# EAGLE design dcf77_26v0v0 (EAGLE 6.6.0)
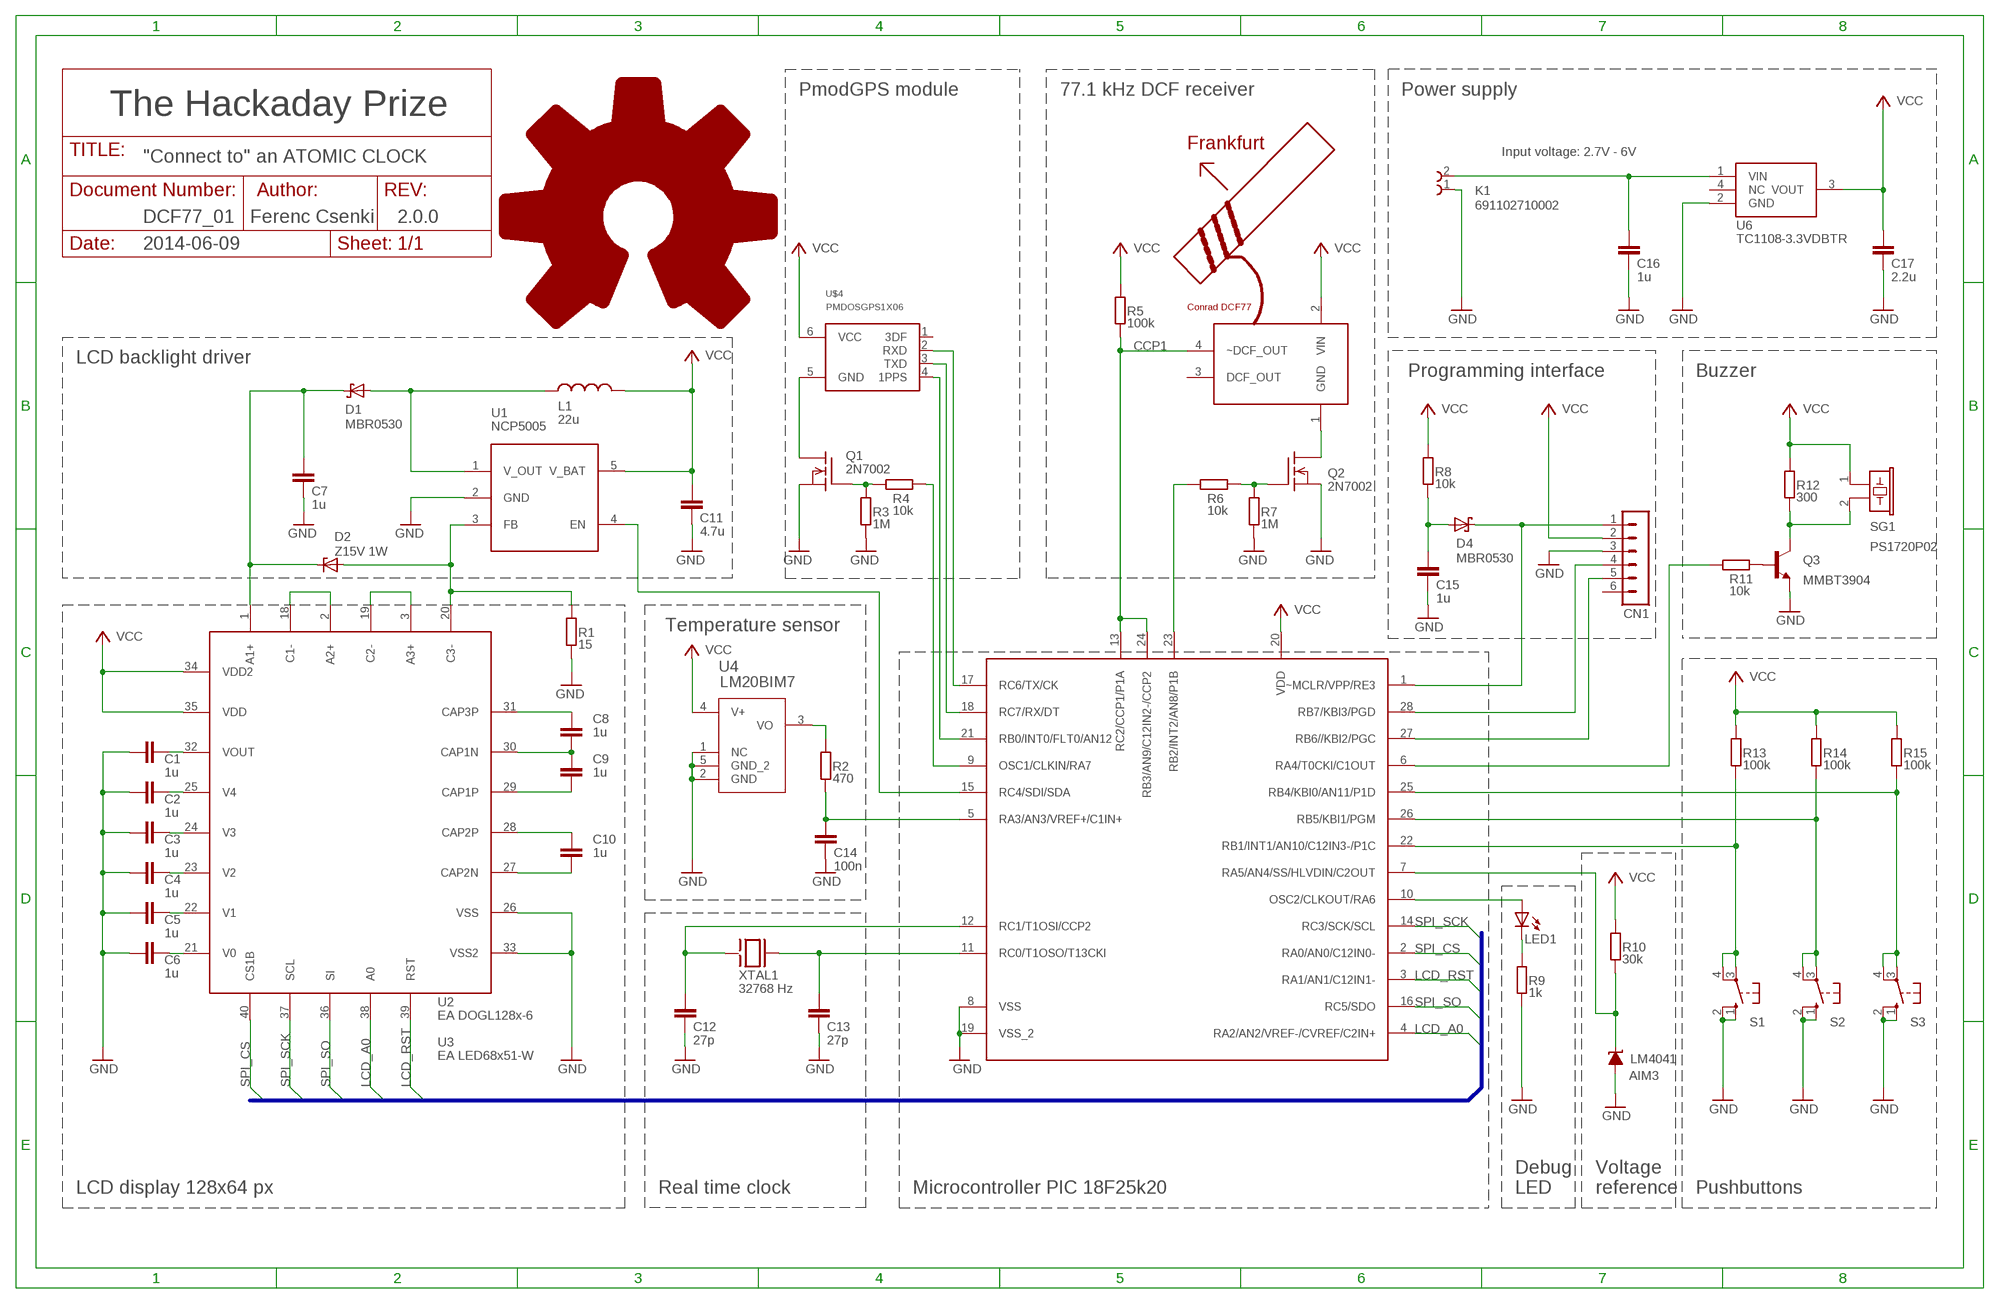
[diagram p0: schematic, sheet 1]

## Parts
C1  1u  C-EUC1206K  [C1206K]
C2  1u  C-EUC1206K  [C1206K]
C3  1u  C-EUC1206K  [C1206K]
C4  1u  C-EUC1206K  [C1206K]
C5  1u  C-EUC1206K  [C1206K]
C6  1u  C-EUC1206K  [C1206K]
C7  1u  C-EUC1206K  [C1206K]
C8  1u  C-EUC1206K  [C1206K]
C9  1u  C-EUC1206K  [C1206K]
C10  1u  C-EUC1206K  [C1206K]
C11  4.7u  C-EUC1206K  [C1206K]
C12  27p  C-EUC1206K  [C1206K]
C13  27p  C-EUC1206K  [C1206K]
C14  100n  C-EUC1206K  [C1206K]
C15  1u  C-EUC1206K  [C1206K]
C16  1u  C-EUC1206K  [C1206K]
C17  2.2u  C-EUC1206K  [C1206K]
CN1  MA06-1  [MA06-1]
D1  MBR0530  SCHOTTKY-DIODE  [SOD123]
D2  Z15V 1W  ZENER-DIODESMB  [SMB]
D4  MBR0530  SCHOTTKY-DIODE  [SOD123]
K1  691102710002  [691102710002]
K2  691121710004DCF77_PINHEADER  [1X06]
L1  22u  L-USL1812  [L1812]
LED1  LEDCHIPLED_1206  [CHIPLED_1206]
LM4041  LM4041A12DBZ  [DBZ_R-PDSO-G3]
MMBT3904  T1  BC849SMD  [SOT23-BEC]
Q1  2N7002  [SOT23]
Q2  2N7002  [SOT23]
R1  15  R-EU_R1206  [R1206]
R2  470  R-EU_R1206  [R1206]
R3  1M  R-EU_R1206  [R1206]
R4  10k  R-EU_R1206  [R1206]
R5  100k  R-EU_R1206  [R1206]
R6  10k  R-EU_R1206  [R1206]
R7  1M  R-EU_R1206  [R1206]
R8  10k  R-EU_R1206  [R1206]
R9  1k  R-EU_R1206  [R1206]
R10  30k  R-EU_R1206  [R1206]
R11  10k  R-EU_R1206  [R1206]
R12  300  R-EU_R1206  [R1206]
R13  100k  R-EU_R1206  [R1206]
R14  100k  R-EU_R1206  [R1206]
R15  100k  R-EU_R1206  [R1206]
S1  40-XX  [B3F-40XX]
S2  40-XX  [B3F-40XX]
S3  40-XX  [B3F-40XX]
SG1  F/EE17P  [F/EE17P]
U1  NCP5005  [LTC6900]
U4  LM20BIM7  [SOT65P240X110-5N]
U6  TC1108-3.3VDBTR  3V3REGSOT223  [SOT223]
U$2  DOGL128_DEV  [EA_DOGL128-6]
U$4  PMDOSGPS1X06  [1X06]
U$113  PICDIL28VARIANT  [DIL28]
XTAL1  32768 Hz  38KHZ  [38KHZ]

## Nets
B1: MMBT3904.C R12.2 SG1.2
CCP1: K2.4(~DCF_OUT) R5.1 U$113.13(RC2/CCP1/P1A) U$113.24(RB3/AN9/C12IN2-/CCP2)
GND: C1.1 C2.1 C3.1 C4.1 C5.1 C6.1 C7.1 C11.1 C12.1 C13.1 C14.2 C15.1 C16.1 C17.1 CN1.3 K1.1 LM4041.2(A) MMBT3904.E Q1.2(S) Q2.2(S) R1.1 R3.2 R7.2 R9.1 S1.1(S) S1.2(S1) S2.1(S) S2.2(S1) S3.1(S) S3.2(S1) U1.2(GND) U4.1(NC) U4.2(GND) U4.5(GND_2) U6.2(GND) U$2.26(VSS) U$2.33(VSS2) U$113.8(VSS) U$113.19(VSS_2)
LCD_A0: U$2.38(A0) U$113.4(RA2/AN2/VREF-/CVREF/C2IN+)
LCD_RST: U$2.39(RST) U$113.3(RA1/AN1/C12IN1-)
N$1: C10.2 U$2.27(CAP2N)
N$2: C10.1 U$2.28(CAP2P)
N$3: C9.1 U$2.29(CAP1P)
N$4: C8.2 U$2.31(CAP3P)
N$5: C3.2 U$2.24(V3)
N$6: C8.1 C9.2 U$2.30(CAP1N)
N$7: C4.2 U$2.23(V2)
N$8: C5.2 U$2.22(V1)
N$9: C6.2 U$2.21(V0)
N$10: C12.2 U$113.12(RC1/T1OSI/CCP2) XTAL1.P$1
N$11: C13.2 U$113.11(RC0/T1OSO/T13CKI) XTAL1.P$2
N$12: C2.2 U$2.25(V4)
N$13: C1.2 U$2.32(VOUT)
N$14: K2.1(GND) Q2.3(D)
N$15: CN1.1 D4.C U$113.1(~MCLR/VPP/RE3)
N$16: LED1.A U$113.10(OSC2/CLKOUT/RA6)
N$17: CN1.4 U$113.28(RB7/KBI3/PGD)
N$18: CN1.5 U$113.27(RB6//KBI2/PGC)
N$19: R13.1 S1.3(P) S1.4(P1) U$113.22(RB1/INT1/AN10/C12IN3-/P1C)
N$20: R14.1 S2.3(P) S2.4(P1) U$113.26(RB5/KBI1/PGM)
N$21: R15.1 S3.3(P) S3.4(P1) U$113.25(RB4/KBI0/AN11/P1D)
N$22: D1.A L1.1 U1.1(V_OUT)
N$23: R4.2 U$113.9(OSC1/CLKIN/RA7)
N$24: C7.2 D1.C D2.C U$2.1(A1+)
N$25: U$2.2(A2+) U$2.18(C1-)
N$26: U$2.3(A3+) U$2.19(C2-)
N$27: LED1.C R9.2
N$28: U$4.2(RXD) U$113.17(RC6/TX/CK)
N$29: U1.4(EN) U$113.15(RC4/SDI/SDA)
N$30: D2.A R1.2 U1.3(FB) U$2.20(C3-)
N$31: R11.2 U$113.6(RA4/T0CKI/C1OUT)
N$33: R6.2 U$113.23(RB2/INT2/AN8/P1B)
N$34: C16.2 K1.2 U6.1(VIN)
N$35: LM4041.1(C) R10.2 U$113.7(RA5/AN4/SS/HLVDIN/C2OUT)
N$36: Q1.3(D) U$4.5(GND)
N$37: Q2.1(G) R6.1 R7.1
N$38: C15.2 D4.A R8.1
N$39: Q1.1(G) R3.1 R4.1
N$40: R2.2 U4.3(VO)
N$41: U$4.3(TXD) U$113.18(RC7/RX/DT)
N$42: C14.1 R2.1 U$113.5(RA3/AN3/VREF+/C1IN+)
N$43: MMBT3904.B R11.1
N$44: U$4.4(1PPS) U$113.21(RB0/INT0/FLT0/AN12)
SPI_CS: U$2.40(CS1B) U$113.2(RA0/AN0/C12IN0-)
SPI_SCK: U$2.37(SCL) U$113.14(RC3/SCK/SCL)
SPI_SO: U$2.36(SI) U$113.16(RC5/SDO)
VCC: C11.2 C17.2 CN1.2 K2.2(VIN) L1.2 R5.2 R8.2 R10.1 R12.1 R13.2 R14.2 R15.2 SG1.1 U1.5(V_BAT) U4.4(V+) U6.3(VOUT) U$2.34(VDD2) U$2.35(VDD) U$4.6(VCC) U$113.20(VDD)
Unconnected: CN1.6 K2.3(DCF_OUT) U6.4(NC) U$4.1(3DF)

## Buses
SPI_CS,LCD_RST,LCD_A0,SPI_SCK,SPI_SO

## Notes on the sheet
- PmodGPS module | 77.1 kHz DCF receiver | Power supply
- The Hackaday Prize
- Input voltage: 2.7V - 6V
- "Connect to" an ATOMIC CLOCK
- DCF77_01 | Ferenc Csenki | 2.0.0
- 2014-06-09
- LCD backlight driver
- Programming interface | Buzzer
- PS1720P02
- Q3
- Temperature sensor
- U2
- EA DOGL128x-6
- U3
- EA LED68x51-W
- AIM3
- Debug | Voltage
- LCD display 128x64 px | Real time clock | Microcontroller PIC 18F25k20 | LED | reference | Pushbuttons

## Library data of the parts
C1-C17 = resistor:C-EU: CAPACITOR, European symbol
CN1 = con-lstb:MA06-1: PIN HEADER; OC_FARNELL: unknown; OC_NEWARK: unknown
D1 D4 = diode:SCHOTTKY-DIODE: Schottky Diode
D2 = diode:ZENER-DIODE: Z-Diode
K1 = Wuerth_Elektronik_eiCan_Terminal_Blocks_Connectors:691102710002: WR-TBL Serie 102 - 5.0mm Horizontal Entry Modular with Pressure Clamp - 1.5mm2 Wires, 2 Pins
K2 = conrad_dcf77:691121710004: WR-TBL Serie 121 - 5.0mm Horizontal Entry Modular With Pressure Clamp - 3.3mm2 Wires, 4 Pins
L1 = rcl:L-US: INDUCTOR, American symbol
LED1 = led:LED: LED OSRAM: - CHIPLED LG R971, LG N971, LY N971, LG Q971, LY Q971, LO R971, LY R971 LH N974, LH R974 LS Q976, LO Q976, LY Q976 LO Q996 - Hyper CHIPLED LW Q18S LB Q993, LB Q99A, LB R99A - SideLED LS A670, LO A670, LY A670, LG A670, LP A670 LB A673, LV A673, LT A673, LW A673 LH A674 LY A675 LS A676, LA A676, LO A676, LY A676, LW A676 LS A679, LY A679, LG A679 - Hyper Micro SIDELED® LS Y876, LA Y876, LO Y876, LY Y876 LT Y87S - SmartLED LW L88C, LW L88S LB L89C, LB L89S, LG L890 LS L89K, LO L89K, LY L89K LS L896, LA L896, LO L896, LY L896 - TOPLED LS T670, LO T670, LY T670, LG T670, LP T670 LSG T670, LSP T670, LSY T670, LOP T670, LYG T670 LG T671, LOG T671, LSG T671 LB T673, LV T673, LT T673, LW T673 LH T674 LS T676, LA T676, LO T676, LY T676, LB T676, LH T676, LSB T676, LW T676 LB T67C, LV T67C, LT T67C, LS T67K, LO T67K, LY T67K, LW E67C LS E67B, LA E67B, LO E67B, LY E67B, LB E67C, LV E67C, LT E67C LW T67C LS T679, LY T679, LG T679 LS T770, LO T770, LY T770, LG T770, LP T770 LB T773, LV T773, LT T773, LW T773 LH T774 LS E675, LA E675, LY E675, LS T675 LS T776, LA T776, LO T776, LY T776, LB T776 LHGB T686 LT T68C, LB T68C - Hyper Mini TOPLED® LB M676 - Mini TOPLED Santana® LG M470 LS M47K, LO M47K, LY M47K Source: http://www.osram.convergy.de LUXEON: - LUMILED® LXK2-PW12-R00, LXK2-PW12-S00, LXK2-PW14-U00, LXK2-PW14-V00 LXK2-PM12-R00, LXK2-PM12-S00, LXK2-PM14-U00 LXK2-PE12-Q00, LXK2-PE12-R00, LXK2-PE12-S00, LXK2-PE14-T00, LXK2-PE14-U00 LXK2-PB12-K00, LXK2-PB12-L00, LXK2-PB12-M00, LXK2-PB14-N00, LXK2-PB14-P00, LXK2-PB14-Q00 LXK2-PR12-L00, LXK2-PR12-M00, LXK2-PR14-Q00, LXK2-PR14-R00 LXK2-PD12-Q00, LXK2-PD12-R00, LXK2-PD12-S00 LXK2-PH12-R00, LXK2-PH12-S00 LXK2-PL12-P00, LXK2-PL12-Q00, LXK2-PL12-R00 Source: www.luxeon.com KINGBRIGHT: KA-3528ASYC Source: www.kingbright.com
LM4041 = texas:LM4041: PRECISION MICROPOWER SHUNT VOLTAGE REFERENCE Source: http://focus.ti.com/lit/ds/slcs146e/slcs146e.pdf; MPN: LM4041A12IDBZR; OC_FARNELL: 1407949; OC_NEWARK: 58K5875
MMBT3904 = transistor-npn:BC849*: NPN Transistor
Q1 Q2 = transistors_gaui:2N7002
R1-R15 = rcl:R-EU_: RESISTOR, European symbol
S1-S3 = switch-omron:40-XX: OMRON SWITCH; MF: OMRON COMPONENTS USA; MPN: B3F-4000; OC_FARNELL: 176434; OC_NEWARK: 36K3105
SG1 = buzzer:F/EE17P: BUZZER Source: Buerklin; OC_FARNELL: unknown; OC_NEWARK: unknown
U1 = NCP5005:NCP5005
U4 = lm20:LM20BIM7: micro SMD Temperature Sensor; MPN: LM20BIM7; OC_FARNELL: 9779264; OC_NEWARK: 25C3870; PACKAGE: SC-70-5; SUPPLIER: National Semiconductors
U6 = 3v3reg:3V3REG
U$2 = ea:DOGL128_DEV
U$4 = PmodGPS:PMDOSGPS
U$113 = pic:PIC
XTAL1 = xtal:38KHZ

## Board
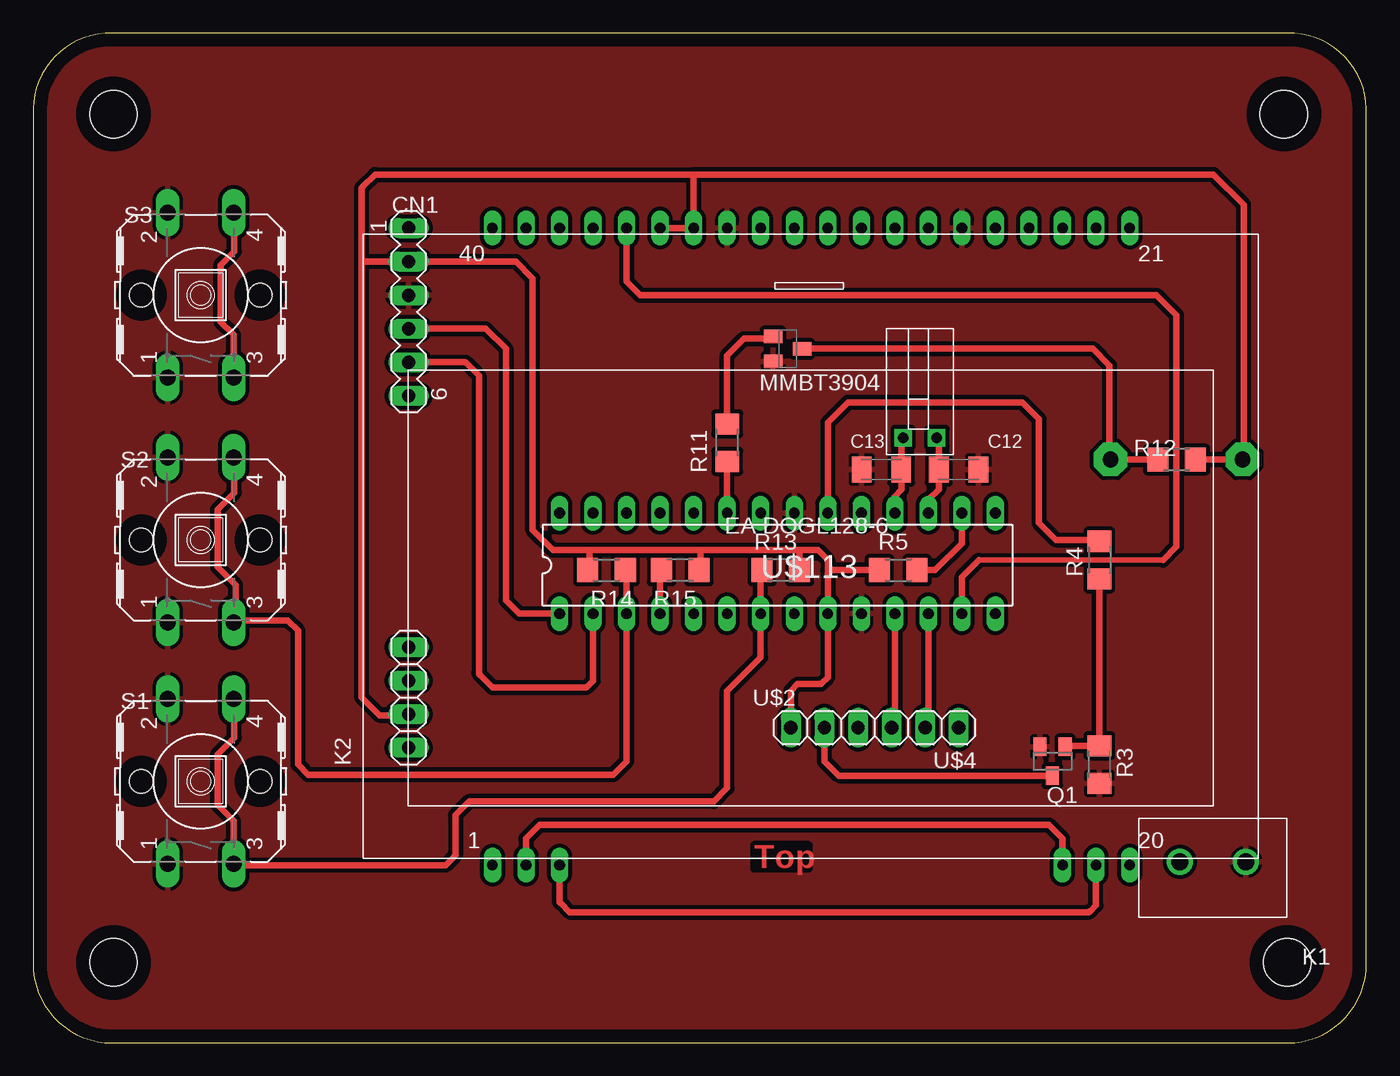
[diagram p1: board, top side]
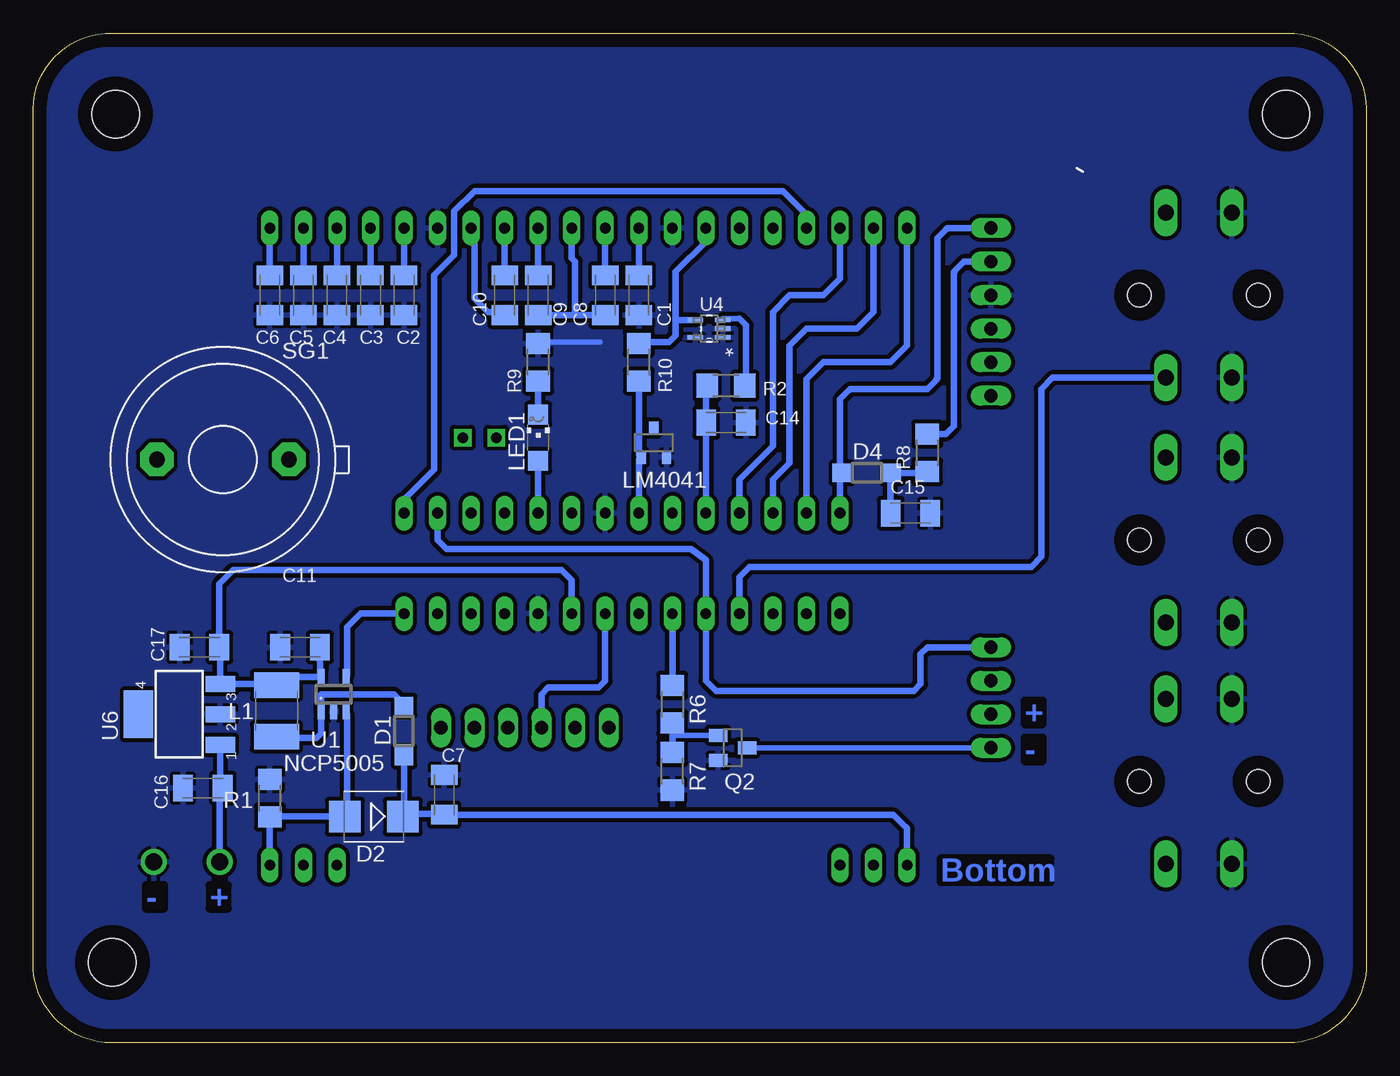
[diagram p2: board, bottom side, seen from below]

Size 101 x 76.5 mm. Coordinates in mm from the lower left corner, seen from the top.
Outline: 101,6 101,70.75 arc90 95,76.5 6,76.5 arc90 0,70.75 0,6 arc90 6,0 95,0 arc90 101,6
Copper layers (1*16): Top 0.035mm / dielectric 1.5mm / Bottom 0.035mm
Design rules "default *": minimum track width 20mil, minimum drill 24mil, track to track 12mil, track to pad 12mil, pad to pad 12mil, via to via 12mil, smd to smd 12mil, copper to edge 40mil, drill to drill 8mil, minimum pad ring 10mil, minimum via ring 8mil, stop-mask expansion 4mil, vias tented up to drill 0mil, thermal gap 10mil
Holes 3.6 mm at 6.1,70.36 95,6.1 94.74,70.36 6.1,6.1

### Footprints (pad centres in the part's own frame; a part is rotated, then mirrored left to right if it is on the bottom)
C1206K = smd 1.5 x 2: 1 -1.5,0; 2 1.5,0
MA06-1 = drill 1.016 long: 1 -6.35,0; 2 -3.81,0; 3 -1.27,0; 4 1.27,0; 5 3.81,0; 6 6.35,0
SOD123 = smd 1.4 x 1.4: A 1.9,0; C -1.9,0
SMB = smd 2.4 x 2.4: A 2.2,0; C -2.2,0
691102710002 = drill 1.3: 1 -5,0; 2 0,0
1X06 = drill 1.016 long: 1 -1.27,0; 2 1.27,0; 3 3.81,0; 4 6.35,0
L1812 = smd 1.9 x 3.4: 1 -1.95,0; 2 1.95,0
CHIPLED_1206 = smd 1.5 x 1.5: A 0,-1.75; C 0,1.75
DBZ_R-PDSO-G3 = smd 0.7 x 1: 1 -0.95,-1.1; 2 0.95,-1.1; 3 0,1.1
SOT23-BEC = smd 1 x 1.4: B -0.95,-1.1; C 0,1.1; E 0.95,-1.1
SOT23 = smd 1 x 1.4: 1 -0.95,-1.1; 2 0.95,-1.1; 3 0,1.1
R1206 = smd 1.6 x 1.803: 1 -1.422,0; 2 1.422,0
B3F-40XX = drill 1.194 long: 1 -6.248,2.489; 2 6.248,2.489; 3 -6.248,-2.489; 4 6.248,-2.489 | hole 1.803: 0,-4.496; 0,4.496
F/EE17P = drill 1.194 pad 2.54 octagon: 1 -5.004,0; 2 5.004,0
LTC6900 = smd 0.55 x 1.2: 1 -0.95,-1.3; 2 0,-1.3; 3 0.95,-1.3; 4 0.95,1.3; 5 -0.95,1.3
SOT65P240X110-5N = smd 1.168 x 0.356: 1 -1.041,0.66; 2 -1.041,0; 3 -1.041,-0.66; 4 1.041,-0.66; 5 1.041,0.66
SOT223 = smd 1.219 x 2.235: 1 -2.311,-3.099; 2 0,-3.099; 3 2.311,-3.099 | smd 3.6 x 2.2: 4 0,3.099
EA_DOGL128-6 = drill 0.813 long: 1 0,0; 2 2.54,0; 3 5.08,0; 18 43.18,0; 19 45.72,0; 20 48.26,0; 21 48.26,48.26; 22 45.72,48.26; 23 43.18,48.26; 24 40.64,48.26; 25 38.1,48.26; 26 35.56,48.26; 27 33.02,48.26; 28 30.48,48.26; 29 27.94,48.26; 30 25.4,48.26; 31 22.86,48.26; 32 20.32,48.26; 33 17.78,48.26; 34 15.24,48.26; 35 12.7,48.26; 36 10.16,48.26; 37 7.62,48.26; 38 5.08,48.26; 39 2.54,48.26; 40 0,48.26
1X06' = drill 1.016 long: 1 -6.35,0; 2 -3.81,0; 3 -1.27,0; 4 1.27,0; 5 3.81,0; 6 6.35,0
DIL28 = drill 0.813 long: 1 -15.24,7.62; 2 -12.7,7.62; 3 -10.16,7.62; 4 -7.62,7.62; 5 -5.08,7.62; 6 -2.54,7.62; 7 0,7.62; 8 2.54,7.62; 9 5.08,7.62; 10 7.62,7.62; 11 10.16,7.62; 12 12.7,7.62; 13 15.24,7.62; 14 17.78,7.62; 15 17.78,0; 16 15.24,0; 17 12.7,0; 18 10.16,0; 19 7.62,0; 20 5.08,0; 21 2.54,0; 22 0,0; 23 -2.54,0; 24 -5.08,0; 25 -7.62,0; 26 -10.16,0; 27 -12.7,0; 28 -15.24,0
38KHZ = drill 0.8 square: P$1 8.255,0.635; P$2 8.255,-1.905

### Placement (x,y rotation side)
C1  55.12,56.64 90 bottom
C2  72.9,56.64 90 bottom
C3  75.44,56.64 90 bottom
C4  77.98,56.64 90 bottom
C5  80.52,56.64 90 bottom
C6  83.06,56.64 90 bottom
C7  69.85,18.8 270 bottom
C8  57.66,56.64 90 bottom
C9  62.74,56.64 270 bottom
C10  65.28,56.64 270 bottom
C11  80.77,29.97 0 bottom
C12  70.1,43.43 180 top
C13  64.26,43.43 0 top
C14  48.51,46.99 0 bottom
C15  34.54,40.13 180 bottom
C16  88.14,19.3 0 bottom
C17  88.39,29.97 0 bottom
CN1  28.45,55.37 270 top
D1  72.9,23.62 90 bottom
D2  75.18,17.14 180 bottom
D4  37.85,43.18 0 bottom
K1  86.87,13.72 180 top
K2  28.45,23.62 90 top
L1  82.55,25.15 90 bottom
LED1  62.74,45.85 0 bottom
LM4041  53.98,45.47 0 bottom
MMBT3904  57.15,52.58 270 top
Q1  77.22,21.34 180 top
Q2  48.01,22.35 270 bottom
R1  83.06,18.54 270 bottom
R2  48.51,49.78 0 bottom
R3  80.77,21.08 270 top
R4  80.77,36.58 90 top
R5  65.53,35.81 180 top
R6  52.58,25.65 90 bottom
R7  52.58,20.57 270 bottom
R8  33.27,44.7 90 bottom
R9  62.74,51.56 270 bottom
R10  55.12,51.56 270 bottom
R11  52.58,45.47 270 top
R12  86.61,44.2 180 top
R13  56.64,35.81 0 top
R14  43.43,35.81 180 top
R15  49.02,35.81 0 top
S1  12.7,19.81 90 top
S2  12.7,38.1 90 top
S3  12.7,56.64 90 top
SG1  86.61,44.2 0 bottom
U1  78.23,26.42 0 bottom
U4  49.78,54.1 180 bottom
U6  89.92,24.89 90 bottom
U$2  34.8,13.46 0 top
U$3  [OSHW_8X350_NOTEXT]  24.89,65.53 0 bottom
U$4  PMDOSGPS1X06  [1X06']  63.75,23.88 180 top
U$113  55.12,32.51 0 top
XTAL1  67.82,54.1 270 top

### Tracks (layer width: path | path; a pad name or v marks a point on that pad's centre or on a via)
B1
  Top 0.508: R12.2 SG1.2 81.53,44.27 81.53,51.31 80.26,52.58 MMBT3904.C
CCP1
  Top 0.508: U$113.13 70.36,37.85 68.33,35.81 R5.1
  Bottom 0.508: U$113.13 70.36,38.1 69.69,37.43 51.15,37.43 50.04,36.58 U$113.24 50.04,27.43 49.28,26.67 34.29,26.67 33.78,27.18 33.78,29.46 33.27,29.97 K2.4
GND
  Bottom 0.406: 58.04,53.09 62.74,53.09
  Bottom 0.508: 62.74,53.09 R9.1
  pour Bottom: 100.6,6.46 100.82,69.96 arc90 94.85,75.98 6.5,76.42 arc90 0.47,70.46 0.04,6.07 arc91 6.07,0.03 94.63,0.48 arc90
  pour Top: 0.47,70.48 0.55,6.07 arc91 6.58,0.03 94.61,0.48 arc90 100.58,6.48 100.58,70.22 arc90 94.6,76.22 6.48,76.44 arc90
LCD_A0
  Bottom 0.508: U$2.38 39.88,57.91 41.15,56.64 43.69,56.64 44.96,55.37 44.96,45.21 47.5,42.67 U$113.4
LCD_RST
  Bottom 0.508: U$2.39 37.34,55.37 38.61,54.1 42.42,54.1 43.69,52.83 43.69,43.94 44.96,42.67 U$113.3
N$1
  Bottom 0.508: U$2.27 67.82,60.71 67.56,60.45 67.56,56.39 66.55,55.37 65.28,55.37 C10.2
N$2
  Bottom 0.508: C10.1 U$2.28
N$3
  Bottom 0.508: C9.1 U$2.29
N$4
  Bottom 0.508: C8.2 U$2.31
N$5
  Bottom 0.508: C3.2 U$2.24
N$6
  Bottom 0.508: 59.94,55.12 62.74,55.12 C9.2 | 59.94,55.12 57.66,55.12 C8.1 | U$2.30 60.2,59.44 59.94,59.18 59.94,55.12
N$7
  Bottom 0.508: C4.2 U$2.23
N$8
  Bottom 0.508: C5.2 U$2.22
N$9
  Bottom 0.508: U$2.21 C6.2
N$10
  Top 0.508: U$113.12 67.82,41.15 68.6,41.93 C12.2 68.6,45.7 XTAL1.P$1
N$11
  Top 0.406: C13.2 65.79,43.43
  Top 0.508: 65.79,43.43 65.79,41.91 65.28,41.4 U$113.11 | C13.2 65.76,43.66 65.79,43.69 65.79,45.72 XTAL1.P$2
N$12
  Bottom 0.508: C2.2 U$2.25
N$13
  Bottom 0.508: C1.2 U$2.32
N$14
  Bottom 0.406: K2.1 Q2.3
N$15
  Bottom 0.508: CN1.1 31.64,61.72 arc-45 31.82,61.65 32.51,60.96 32.51,50.4 arc45 32.59,50.22 33.27,49.53 39.01,49.53 arc-45 39.19,49.46 39.88,48.77 39.88,43.42 arc-45 39.8,43.24 D4.C 39.8,43.12 arc-45 39.88,42.94 U$113.1
N$16
  Bottom 0.508: U$113.10 LED1.A
N$17
  Top 0.508: CN1.4 34.29,54.1 35.81,52.58 35.81,33.53 36.83,32.51 U$113.28
N$18
  Top 0.508: U$113.27 42.42,27.43 41.98,27 arc-45 41.8,26.92 34.8,26.92 33.86,27.87 arc-45 33.78,28.05 33.78,50.55 32.84,51.49 arc45 32.66,51.56 CN1.5
N$19
  Top 0.508: S1.4 15.24,26.01 15.24,23.11 13.97,21.84 13.97,18.03 15.19,16.82 S1.3 15.29,13.46 31.24,13.46 31.93,14.15 arc45 32,14.33 32,17.27 32.95,18.21 arc-45 33.12,18.29 51.56,18.29 52.58,19.3 52.58,26.67 55.12,29.21 U$113.22 55.12,36.47 R13.1
N$20
  Top 0.508: 15.34,32 19.3,32 20.07,31.24 20.07,21.08 20.83,20.32 43.94,20.32 44.96,21.34 U$113.26 44.96,35.71 R14.1 | 15.34,32 S2.3 | 15.34,32 15.34,34.7 13.97,36.07 13.97,40.39 15.24,41.66 15.24,44.3 S2.4
N$21
  Top 0.508: S3.3 15.19,53.64 14.22,54.61 14.22,58.93 15.24,59.94 15.24,62.84 S3.4 | U$113.25 47.5,35.71 R15.1
  Bottom 0.508: S3.3 23.77,50.39 24.64,49.53 24.64,36.83 25.4,36.07 46.74,36.07 47.5,35.31 U$113.25
N$22
  Bottom 0.406: 82.47,23.11 L1.1 | D1.A 72.9,25.55 arc-45 72.97,25.73 | 79.25,25.53 arc-45 U1.1
  Bottom 0.508: 82.47,23.11 79.5,23.11 79.18,23.43 U1.1 79.18,26.42 78.49,26.42 73.66,26.42 72.97,25.73
N$23
  Top 0.508: U$113.9 60.2,46.99 61.72,48.51 74.93,48.51 76.2,47.24 76.2,39.37 77.47,38.1 80.67,38.1 R4.2
N$24
  Bottom 0.406: 72.9,17.14 D2.C 72.97,17.16 arc-45 72.9,17.34
  Bottom 0.508: D1.C 72.9,17.34 70.25,17.34 arc45 70.07,17.26 C7.2 arc-45 69.79,17.27 35.81,17.27 34.87,16.33 arc45 34.8,16.15 U$2.1
N$25
  Top 0.508: U$2.18 77.98,15.49 76.96,16.51 38.35,16.51 37.34,15.49 U$2.2
N$26
  Top 0.508: 39.88,11.18 U$2.3 39.88,10.77 arc45 39.95,10.59 40.64,9.91 79.91,9.91 arc45 80.08,9.98 80.52,10.41 U$2.19
N$27
  Bottom 0.508: LED1.C R9.2
N$28
  Top 0.508: U$113.17 67.82,24.13 U$4.2
N$29
  Bottom 0.508: U$113.15 76.2,32.51 77.22,31.5 77.22,27.78 U1.4
N$30
  Bottom 0.406: 83.06,17.14 R1.2 | 77.22,17.02 77.47,17.02 77.38,17.1 | 77.31,25.15 U1.3 77.28,24.96 77.22,24.89
  Bottom 0.508: 82.8,17.27 83.06,17.27 R1.2 | 82.8,17.27 82.3,17.27 | R1.2 82.8,17.27 | U$2.20 R1.2 | 83.06,17.14 D2.A 77.38,17.1 | 77.22,24.89 77.22,17.02
N$31
  Top 0.508: U$113.6 R11.2
N$33
  Bottom 0.508: R6.2 U$113.23
N$34
  Bottom 0.508: U6.1 86.82,19.3 C16.2 86.87,19.3 K1.2
N$35
  Bottom 0.508: R10.2 55.12,44.56 LM4041.1 55.12,44.17 U$113.7
N$36
  Top 0.508: U$4.5 59.94,21.34 61.04,20.24 Q1.3
N$37
  Bottom 0.406: 52.43,24.38 R6.1 | Q2.1 52.51,23.3 52.58,23.37
  Bottom 0.508: R7.1 52.58,23.37 R6.1
N$38
  Bottom 0.508: C15.2 36.04,42.98 arc45 35.97,43.16 D4.A 33.48,43.18 arc-45 33.3,43.25 R8.1
N$39
  Top 0.508: Q1.1 78.23,22.5 R3.1 R4.1
N$40
  Bottom 0.406: 47.5,54.86 48.74,54.86 U4.3
  Bottom 0.508: R2.2 46.99,49.78 46.99,54.36 47.5,54.86
N$41
  Top 0.508: U$113.18 65.28,24.13 U$4.3
N$42
  Bottom 0.406: C14.1 50.04,46.99
  Bottom 0.508: 50.04,46.99 50.04,49.78 R2.1 | C14.1 50.01,40.16 U$113.5
N$43
  Top 0.508: R11.1 52.58,52.07 53.85,53.34 55.86,53.34 MMBT3904.B
N$44
  Bottom 0.508: U$4.4 62.48,26.42 61.98,26.92 58.17,26.92 57.66,27.43 U$113.21
SPI_CS
  Bottom 0.508: U$2.40 34.8,52.83 36.07,51.56 41.15,51.56 42.42,50.29 U$113.2
SPI_SCK
  Bottom 0.508: U$113.14 72.9,41.15 70.61,43.43 70.61,58.17 69.09,59.69 69.09,62.99 67.56,64.52 44.2,64.52 42.42,62.74 U$2.37
SPI_SO
  Top 0.406: 85.6,36.58 71.63,36.58
  Top 0.508: U$2.36 44.96,57.76 arc45 45.03,57.58 45.97,56.64 85.09,56.64 86.61,55.12 86.61,37.59 85.6,36.58 | 70.36,32.26 U$113.16 70.36,35.31 71.63,36.58
VCC
  Top 0.508: SG1.1 R12.1 91.69,44.2 91.69,63.5 89.41,65.79 50.04,65.79 | U$2.35 U$2.34 50.04,65.79 | 24.89,59.18 24.89,64.67 arc-45 24.97,64.84 25.91,65.79 50.04,65.79 | 24.89,59.18 24.89,26.16 26.24,24.81 28.45,24.81 K2.2 | 24.89,59.18 CN1.2 36.58,59.18 37.85,57.91 37.85,38.86 39.37,37.34 42.16,37.34 | U$4.6 57.4,26.67 57.91,27.18 59.69,27.18 60.2,27.69 U$113.20 60.2,35.81 | 60.2,35.81 60.2,36.58 59.44,37.34 57.91,37.34 | 42.16,37.34 50.55,37.34 | 50.55,37.34 57.91,37.34 | R14.2 42.16,35.81 42.16,37.34 | R15.2 50.55,35.81 50.55,37.34 | R5.2 60.2,35.81 | R13.2 58.06,37.19 57.91,37.34
  Bottom 0.508: 55.12,53.09 R10.1 55.02,53.09 52.83,53.09 52.32,53.59 52.32,54.76 | U$2.34 50.04,60.71 52.32,58.42 52.32,54.76 | U4.4 52.32,54.76 | C11.2 79.25,27.78 U1.5 81.93,27.72 L1.2 82.66,27.2 U6.3 86.82,29.9 C17.2 86.89,34.77 85.85,35.81 60.96,35.81 60.2,35.05 U$113.20 | R8.2 31.96,46.13 arc-45 31.78,46.2 31.24,46.74 31.24,58.31 arc45 31.17,58.49 30.48,59.18 CN1.2

### Text on the board
Top: Top
Bottom: + | - | Bottom | + | -
216bmp: The Hackaday Prize | 1 | 6 | 1 | 4 | 6 | 1 | 1 | 2014 June | Csenki Ferenc